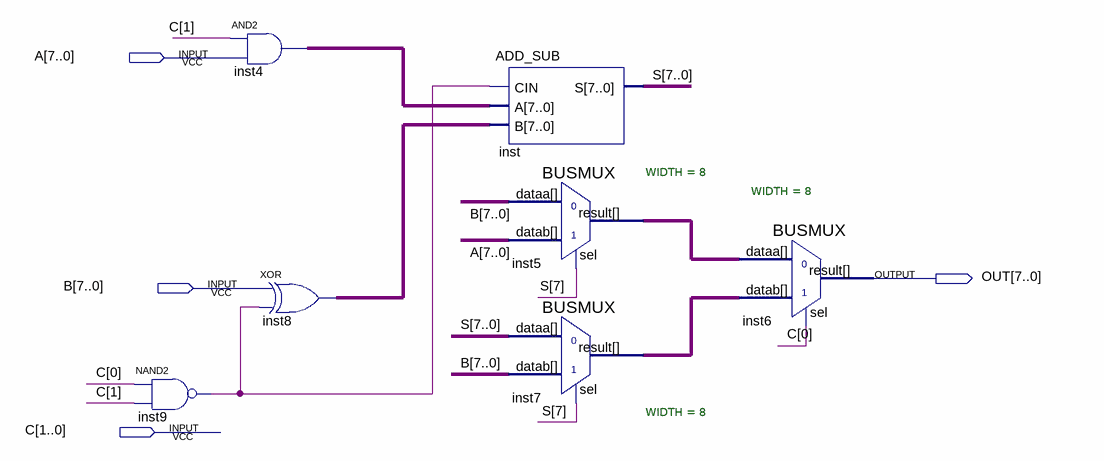
[diagram p0: schematic sheet]
// Quartus schematic MIXUP.bdf as structural Verilog: 7 symbols, 4 pins
module MIXUP (
  input  [7:0] A,
  input  [7:0] B,
  input  [1:0] C,
  output [7:0] OUT
);

  wire inst9_out;
  wire [7:0] inst4_out, inst5_result, inst7_result, inst8_out, S;

  nand inst9 (inst9_out, C[0], C[1]);
  assign inst4_out = {8{C[1]}} & A;  // AND2 inst4, 8 bits wide
  assign inst8_out = B ^ {8{inst9_out}};  // XOR inst8, 8 bits wide
  ADD_SUB inst (.CIN(inst9_out), .A(inst4_out), .B(inst8_out), .S(S));
  BUSMUX #(.WIDTH(8)) inst5 (.datab(A), .sel(S[7]), .dataa(B), .result(inst5_result));
  BUSMUX #(.WIDTH(8)) inst7 (.datab(B), .sel(S[7]), .dataa(S), .result(inst7_result));
  BUSMUX #(.WIDTH(8)) inst6 (.datab(inst7_result), .sel(C[0]), .dataa(inst5_result), .result(OUT));
endmodule
